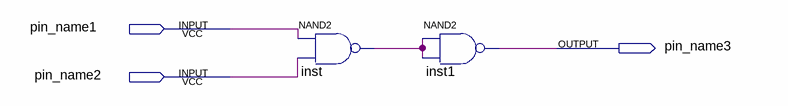
[diagram p0: schematic sheet]
// Quartus schematic second.bdf as structural Verilog: 2 symbols, 3 pins
module second (
  input  pin_name1,
  input  pin_name2,
  output pin_name3
);

  wire inst_out;

  nand inst (inst_out, pin_name1, pin_name2);
  nand inst1 (pin_name3, inst_out, inst_out);
endmodule
